# Altium project mixer_test.PrjPcb
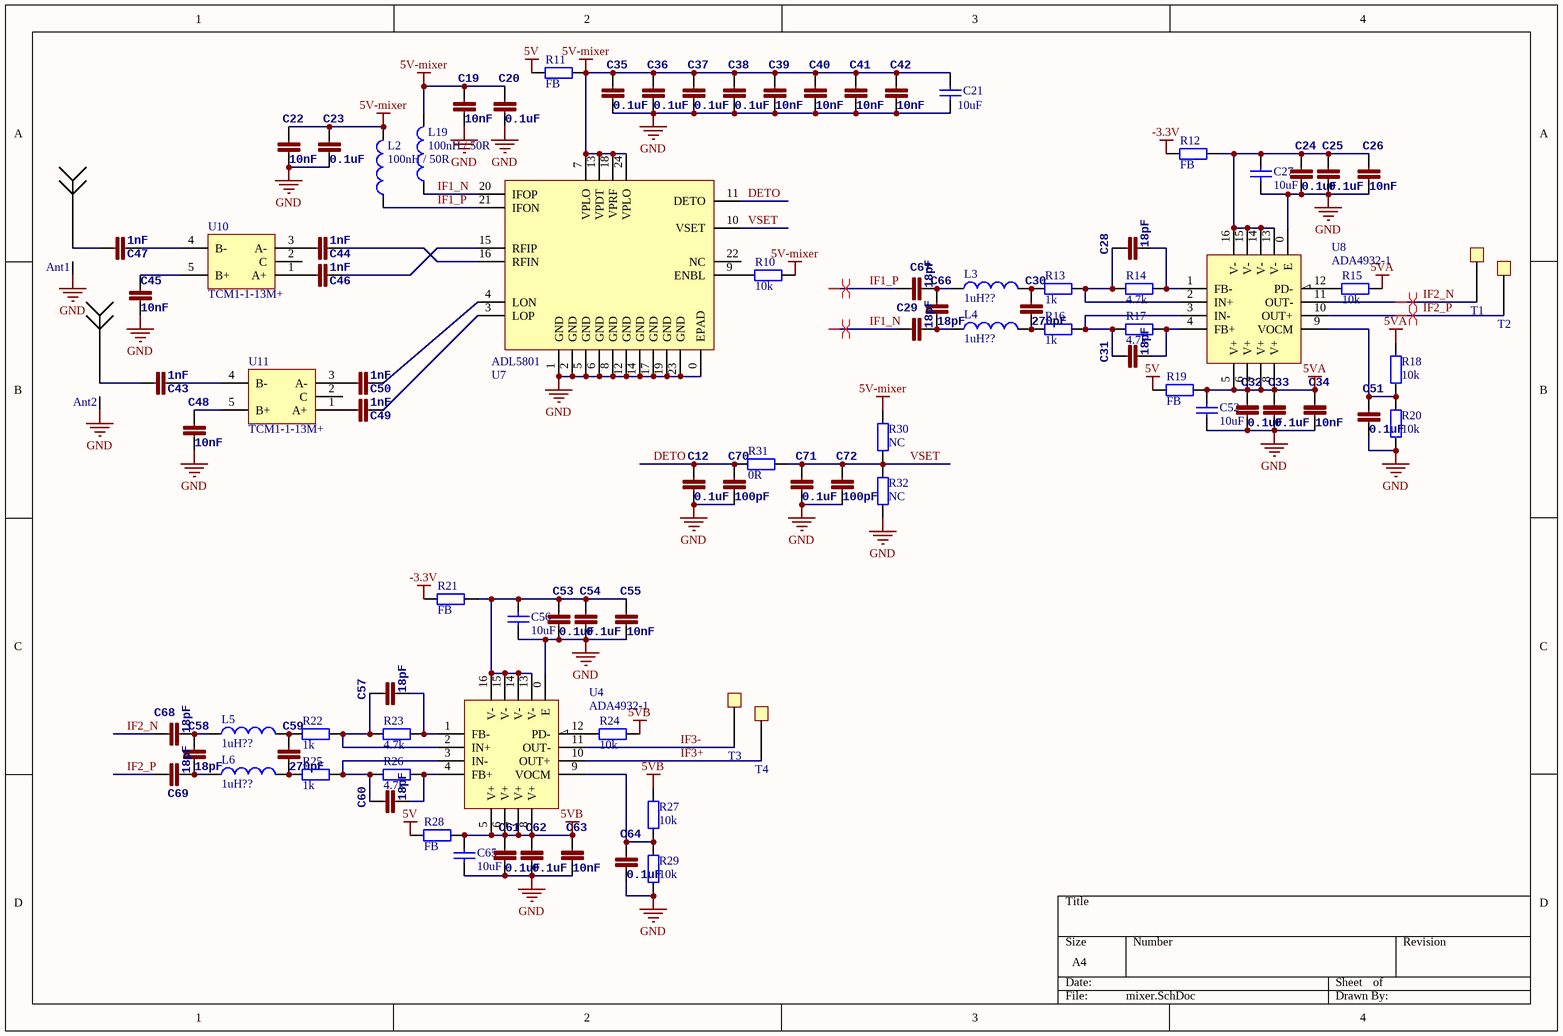
[diagram p0: mixer.SchDoc]
2 sheets, 130 parts. Net scope: global (net labels, ports and power ports of the same name join across sheets).
Board file: mixer_test.PcbDoc
Sheets:
  mixer.SchDoc
  power.SchDoc

## Sheet mixer.SchDoc
size A4

### Parts
Ant1  Antenna  [SMA-2]  (value not drawn)
Ant2  Antenna  [SMA-2]  (value not drawn)
C12  0.1uF  [0402]
C19  10nF  [0402]
C20  0.1uF  [0402]
C21  10uF  [0805]
C22  10nF  [0402]
C23  0.1uF  [0402]
C24  0.1uF  [0402]
C25  0.1uF  [0402]
C26  10nF  [0402]
C27  10uF  [0805]
C28  18pF  [0402]
C29  18pF  [0402]
C30  270pF  [0402]
C31  18pF  [0402]
C32  0.1uF  [0402]
C33  0.1uF  [0402]
C34  10nF  [0402]
C35  0.1uF  [0402]
C36  0.1uF  [0402]
C37  0.1uF  [0402]
C38  0.1uF  [0402]
C39  10nF  [0402]
C40  10nF  [0402]
C41  10nF  [0402]
C42  10nF  [0402]
C43  1nF  [0402]
C44  1nF  [0402]
C45  10nF  [0402]
C46  1nF  [0402]
C47  1nF  [0402]
C48  10nF  [0402]
C49  1nF  [0402]
C50  1nF  [0402]
C51  0.1uF  [0402]
C52  10uF  [0805]
C53  0.1uF  [0402]
C54  0.1uF  [0402]
C55  10nF  [0402]
C56  10uF  [0805]
C57  18pF  [0402]
C58  18pF  [0402]
C59  270pF  [0402]
C60  18pF  [0402]
C61  0.1uF  [0402]
C62  0.1uF  [0402]
C63  10nF  [0402]
C64  0.1uF  [0402]
C65  10uF  [0805]
C66  18pF  [0402]
C67  18pF  [0402]
C68  18pF  [0402]
C69  18pF  [0402]
C70  100pF  [0402]
C71  0.1uF  [0402]
C72  100pF  [0402]
L2  value 100nH / 50R  [0603]  (hidden comment: Inductor)
L3  value 1uH??  [0805]  (hidden comment: Inductor)
L4  value 1uH??  [0805]  (hidden comment: Inductor)
L5  value 1uH??  [0805]  (hidden comment: Inductor)
L6  value 1uH??  [0805]  (hidden comment: Inductor)
L19  value 100nH / 50R  [0603]  (hidden comment: Inductor)
R10  value 10k  [0402]  (hidden comment: Res2)
R11  FB  [0603]
R12  FB  [0603]
R13  value 1k  [0402]  (hidden comment: Res2)
R14  value 4.7k  [0402]  (hidden comment: Res2)
R15  value 10k  [0402]  (hidden comment: Res2)
R16  value 1k  [0402]  (hidden comment: Res2)
R17  value 4.7k  [0402]  (hidden comment: Res2)
R18  value 10k  [0402]  (hidden comment: Res2)
R19  FB  [0603]
R20  value 10k  [0402]  (hidden comment: Res2)
R21  FB  [0603]
R22  value 1k  [0402]  (hidden comment: Res2)
R23  value 4.7k  [0402]  (hidden comment: Res2)
R24  value 10k  [0402]  (hidden comment: Res2)
R25  value 1k  [0402]  (hidden comment: Res2)
R26  value 4.7k  [0402]  (hidden comment: Res2)
R27  value 10k  [0402]  (hidden comment: Res2)
R28  FB  [0603]
R29  value 10k  [0402]  (hidden comment: Res2)
R30  value NC  [0402]  (hidden comment: Res2)
R31  value 0R  [0402]  (hidden comment: Res2)
R32  value NC  [0402]  (hidden comment: Res2)
T1  TestPad  [TestPad - 1mm]  (value not drawn)
T2  TestPad  [TestPad - 1mm]  (value not drawn)
T3  TestPad  [TestPad - 1mm]  (value not drawn)
T4  TestPad  [TestPad - 1mm]  (value not drawn)
U4  ADA4932-1  [ADA4932-1]
U7  ADL5801  [ADL5801]
U8  ADA4932-1  [ADA4932-1]
U10  TCM1-1-13M+  [TCM-63AX+]
U11  TCM1-1-13M+  [TCM-63AX+]

### Nets
5V: R11.1 R19.1 R28.1
5V-mixer: C19.2 C20.2 C21.2 C22.2 C23.2 C35.2 C36.2 C37.2 C38.2 C39.2 C40.2 C41.2 C42.2 L2.2 L19.2 R10.2 R11.2 R30.2 U7.7(VPLO) U7.13(VPDT) U7.18(VPRF) U7.24(VPLO)
5VA: C32.2 C33.2 C34.2 C52.1 R15.2 R18.2 R19.2 U8.5(V+) U8.6(V+) U8.7(V+) U8.8(V+)
5VB: C61.2 C62.2 C63.2 C65.1 R24.2 R27.2 R28.2 U4.5(V+) U4.6(V+) U4.7(V+) U4.8(V+)
-3.3V: R12.1 R21.1
GND: Ant1.GND(G) Ant2.GND(G) C12.1 C19.1 C20.1 C21.1 C22.1 C23.1 C24.1 C25.1 C26.1 C27.2 C32.1 C33.1 C34.1 C35.1 C36.1 C37.1 C38.1 C39.1 C40.1 C41.1 C42.1 C45.1 C48.1 C51.1 C52.2 C53.1 C54.1 C55.1 C56.2 C61.1 C62.1 C63.1 C64.1 C65.2 C70.1 C71.1 C72.1 R20.1 R29.1 R32.1 U4.0(E) U7.0(EPAD) U7.1(GND) U7.2(GND) U7.5(GND) U7.6(GND) U7.8(GND) U7.12(GND) U7.14(GND) U7.17(GND) U7.19(GND) U7.23(GND) U8.0(E)
DETO: C12.2 C70.2 R31.1 U7.11(DETO)
IF1_N: C29.2 L19.1 U7.20(IFOP)
IF1_P: C67.2 L2.1 U7.21(IFON)
IF2_N: C68.2 T1.1 U8.11(OUT-)
IF2_P: C69.2 T2.1 U8.10(OUT+)
IF3+: T4.1 U4.10(OUT+)
IF3-: T3.1 U4.11(OUT-)
VSET: C71.2 C72.2 R30.1 R31.2 R32.2 U7.10(VSET)
NetAnt1_1: Ant1.1 C47.1
NetAnt2_1: Ant2.1 C43.1
NetC24_2: C24.2 C25.2 C26.2 C27.1 R12.2 U8.13(V-) U8.14(V-) U8.15(V-) U8.16(V-)
NetC28_1: C28.1 R14.2 U8.1(FB-)
NetC28_2: C28.2 R13.2 R14.1 U8.2(IN+)
NetC29_1: C29.1 C66.1 L4.1
NetC30_1: C30.1 L4.2 R16.1
NetC30_2: C30.2 L3.2 R13.1
NetC31_1: C31.1 R17.2 U8.4(FB+)
NetC31_2: C31.2 R16.2 R17.1 U8.3(IN-)
NetC43_2: C43.2 U11.4(B-)
NetC44_1: C44.1 U10.3(A-)
NetC44_2: C44.2 U7.16(RFIN)
NetC45_2: C45.2 U10.5(B+)
NetC46_1: C46.1 U10.1(A+)
NetC46_2: C46.2 U7.15(RFIP)
NetC47_2: C47.2 U10.4(B-)
NetC48_2: C48.2 U11.5(B+)
NetC49_1: C49.1 U11.1(A+)
NetC49_2: C49.2 U7.3(LOP)
NetC50_1: C50.1 U11.3(A-)
NetC50_2: C50.2 U7.4(LON)
NetC51_2: C51.2 R18.1 R20.2 U8.9(VOCM)
NetC53_2: C53.2 C54.2 C55.2 C56.1 R21.2 U4.13(V-) U4.14(V-) U4.15(V-) U4.16(V-)
NetC57_1: C57.1 R23.2 U4.1(FB-)
NetC57_2: C57.2 R22.2 R23.1 U4.2(IN+)
NetC58_1: C58.1 C69.1 L6.1
NetC58_2: C58.2 C68.1 L5.1
NetC59_1: C59.1 L6.2 R25.1
NetC59_2: C59.2 L5.2 R22.1
NetC60_1: C60.1 R26.2 U4.4(FB+)
NetC60_2: C60.2 R25.2 R26.1 U4.3(IN-)
NetC64_2: C64.2 R27.1 R29.2 U4.9(VOCM)
NetC66_2: C66.2 C67.1 L3.1
NetR10_1: R10.1 U7.9(ENBL)
NetR15_1: R15.1 U8.12(PD-)
NetR24_1: R24.1 U4.12(PD-)

Not connected (* = marked no-connect by the designer): U7 22(NC); U10 2(C); U11 2(C)

### Layout directives
differential pair: IF1_N, IF1_P, IF2_N, IF2_P

### Library data of the parts
C12 C19 C20 C22-C26 C28-C51 C53-C55 C57-C64 C66-C72 = CAP0402-CAP: <b>Capacitor</b> / Standard 0603 ceramic capacitor, and 0.1" leaded capacitor.; PARTNO: CC0402ZRY5V7BB104
C21 C27 C52 C56 C65 = Cap: Capacitor; Published: 8-Jun-2000; LatestRevisionDate: 17-Jul-2002; LatestRevisionNote: Re-released for DXP Platform.; PackageReference: RAD-0.3; Publisher: Altium Limited; PackageDescription: Radial Cap, Thru-Hole; 2 Leads; 0.3 in Pin Spacing
L2-L6 L19 = Inductor: Code_IEC: 1005; Published: 8-Jun-2000; LatestRevisionDate: 29-May-2009; LatestRevisionNote: IPC-7351 Footprint Added.; PackageReference: 0402-A; Publisher: Altium Limited; PackageDescription: Chip Inductor; Code_JEITA: 0402
R10 R13-R18 R20 R22-R27 R29-R32 = Res2: Resistor; Published: 8-Jun-2000; LatestRevisionDate: 17-Jul-2002; LatestRevisionNote: Re-released for DXP Platform.; PackageReference: AXIAL-0.4; Publisher: Altium Limited; PackageDescription: Axial Device, Thru-Hole; 2 Leads; 0.4 in Pin Spacing
R11 R12 R19 R21 R28 = Res2: Resistor; Value: 0Ohm; Published: 8-Jun-2000; LatestRevisionDate: 17-Jul-2002; LatestRevisionNote: Re-released for DXP Platform.; PackageReference: AXIAL-0.4; Publisher: Altium Limited; PackageDescription: Axial Device, Thru-Hole; 2 Leads; 0.4 in Pin Spacing
U10 U11 = TCM-63AX+

## Sheet power.SchDoc
size A4
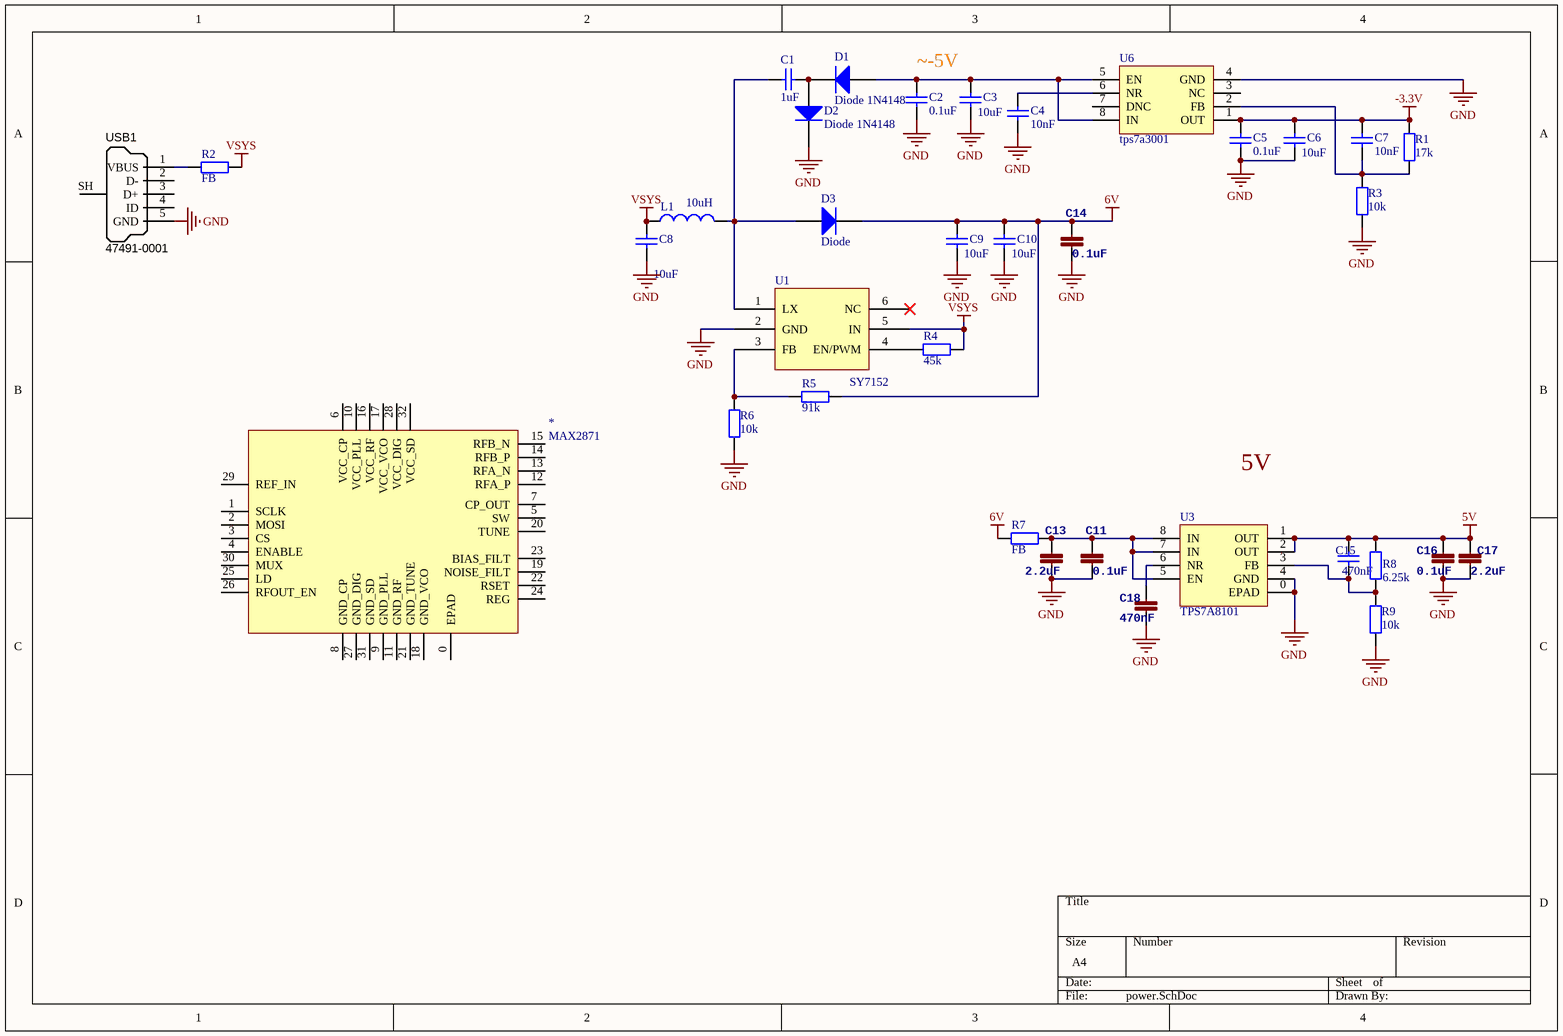
[diagram p1: power.SchDoc]

### Parts
*  MAX2871  [MAX2871]
C1  1uF  [0603]
C2  0.1uF  [0603]
C3  10uF  [0805]
C4  10nF  [0402]
C5  0.1uF  [0603]
C6  10uF  [0805]
C7  10nF  [0402]
C8  10uF  [0805]
C9  10uF  [0805]
C10  10uF  [0805]
C11  0.1uF  [0402]
C13  2.2uF  [0603]
C14  0.1uF  [0402]
C15  470nF  [0402]
C16  0.1uF  [0603]
C17  2.2uF  [0603]
C18  470nF  [0402]
D1  Diode 1N4148  [LC-SOD-323]
D2  Diode 1N4148  [LC-SOD-323]
D3  Diode  [LC-SOD-323]
L1  10uH  [L4015]
R1  17k  [0402]
R2  FB  [0603]
R3  10k  [0402]
R4  45k  [0402]
R5  91k  [0402]
R6  10k  [0402]
R7  FB  [0603]
R8  6.25k  [0402]
R9  10k  [0402]
U1  SY7152  [SOT23-6]
U3  TPS7A8101  [TPS7A8101]
U6  tps7a3001  [MSOP8/VSSOP8]
USB1  Manufacturer Part Number 1: 47491-0001  [MICRO-YZX]  (hidden comment: USB Micro Type B)

### Nets
5V: C15.1 C16.2 C17.2 R8.1 U3.1(OUT) U3.2(OUT)
6V: C9.2 C10.2 C14.2 D3.2(K) R5.2 R7.2
-3.3V: C5.1 C6.2 C7.1 R1.2 U6.1(OUT)
GND: C2.2 C3.1 C4.2 C5.2 C6.1 C8.1 C9.1 C10.1 C11.1 C13.1 C14.1 C16.1 C17.1 C18.1 D2.2(K) R3.1 R6.1 R9.2 U1.2(GND) U3.0(EPAD) U3.4(GND) U6.4(GND) USB1.5(GND)
VSYS: C8.2 L1.1 R2.2 R4.2 U1.5(IN)
NetC1_1: C1.1 D1.2(K) D2.1(A)
NetC1_2: C1.2 D3.1(A) L1.2 U1.1(LX)
NetC2_1: C2.1 C3.2 D1.1(A) U6.5(EN) U6.8(IN)
NetC4_1: C4.1 U6.6(NR)
NetC7_2: C7.2 R1.1 R3.2 U6.2(FB)
NetC11_2: C11.2 C13.2 R7.1 U3.5(EN) U3.7(IN) U3.8(IN)
NetC15_2: C15.2 R8.2 R9.1 U3.3(FB)
NetC18_2: C18.2 U3.6(NR)
NetR2_1: R2.1 USB1.1(VBUS)
NetR4_1: R4.1 U1.4(EN/PWM)
NetR5_1: R5.1 R6.2 U1.3(FB)

Not connected (* = marked no-connect by the designer): * 0(EPAD) 1(SCLK) 2(MOSI) 3(CS) 4(ENABLE) 5(SW) 6(VCC_CP) 7(CP_OUT) 8(GND_CP) 9(GND_PLL) 10(VCC_PLL) 11(GND_RF) 12(RFA_P) 13(RFA_N) 14(RFB_P) 15(RFB_N) 16(VCC_RF) 17(VCC_VCO) 18(GND_VCO) 19(NOISE_FILT) 20(TUNE) 21(GND_TUNE) 22(RSET) 23(BIAS_FILT) 24(REG) 25(LD) 26(RFOUT_EN) 27(GND_DIG) 28(VCC_DIG) 29(REF_IN) 30(MUX) 31(GND_SD) 32(VCC_SD); U1 6(NC)*; U6 3(NC) 7(DNC); USB1 2(D-) 3(D+) 4(ID) SH(Shell)

### Notes on the sheet
- ~-5V
- 5V

### Library data of the parts
C1-C10 C15 = Cap: Capacitor; Published: 8-Jun-2000; LatestRevisionDate: 17-Jul-2002; LatestRevisionNote: Re-released for DXP Platform.; PackageReference: RAD-0.3; Publisher: Altium Limited; PackageDescription: Radial Cap, Thru-Hole; 2 Leads; 0.3 in Pin Spacing
C11 C13 C14 C16-C18 = CAP0402-CAP: as C12 on sheet mixer
D1 D2 = Diode 1N4148: High Conductance Fast Diode; Published: 8-Jun-2000; LatestRevisionDate: 17-Jul-2002; LatestRevisionNote: Re-released for DXP Platform.; DatasheetVersion: 1997; PackageReference: DO-35; Publisher: Altium Limited; PackageDescription: Diode, Axial; Body 3.8 x 1.9 mm (LxDia. max), Lead Dia. 0.53 mm (max); Code_JEDEC: DO-204-AH; ComponentLink1Description: Manufacturer Link; ComponentLink1URL: http://www.fairchildsemi.com/; ComponentLink2Description: Datasheet; ComponentLink2URL: http://www.fairchildsemi.com/ds/1N%2F1N4148.pdf
D3 = Diode: Default Diode; Published: 8-Jun-2000; LatestRevisionDate: 17-Jul-2002; LatestRevisionNote: Re-released for DXP Platform.; PackageVersion: Sep-1996; PackageReference: SMC; Publisher: Altium Limited; PackageDescription: DO-214-AB/SMC; 2 C-Bend Leads; Body 7.9 x 5.9 mm, inc. leads (LxW); Code_JEDEC: DO-214-AB
L1 = Inductor: Code_IEC: 1005; Published: 8-Jun-2000; LatestRevisionDate: 29-May-2009; LatestRevisionNote: IPC-7351 Footprint Added.; PackageReference: 0402-A; Publisher: Altium Limited; PackageDescription: Chip Inductor; Code_JEITA: 0402
R1-R6 = Res2: Resistor; Published: 8-Jun-2000; LatestRevisionDate: 17-Jul-2002; LatestRevisionNote: Re-released for DXP Platform.; PackageReference: AXIAL-0.4; Publisher: Altium Limited; PackageDescription: Axial Device, Thru-Hole; 2 Leads; 0.4 in Pin Spacing
R7-R9 = Res2: Resistor; Value: 0Ohm; Published: 8-Jun-2000; LatestRevisionDate: 17-Jul-2002; LatestRevisionNote: Re-released for DXP Platform.; PackageReference: AXIAL-0.4; Publisher: Altium Limited; PackageDescription: Axial Device, Thru-Hole; 2 Leads; 0.4 in Pin Spacing
USB1 = USB_Micro_TypeB: Connector SMD USB Micro Type B middle mount; Manufacturer 1: Molex Inc; SCDType: undef; Package / Case: SMD; Supplier 1: Digi-Key; Supplier Part Number 1: WM17142CT-ND

## Nets that join several sheets
5V: mixer (R11.1 R19.1 R28.1), power (6 pins)
-3.3V: mixer (R12.1 R21.1), power (5 pins)
GND: mixer (55 pins), power (23 pins)